# EAGLE schematic schützboard9 (EAGLE 4.16)
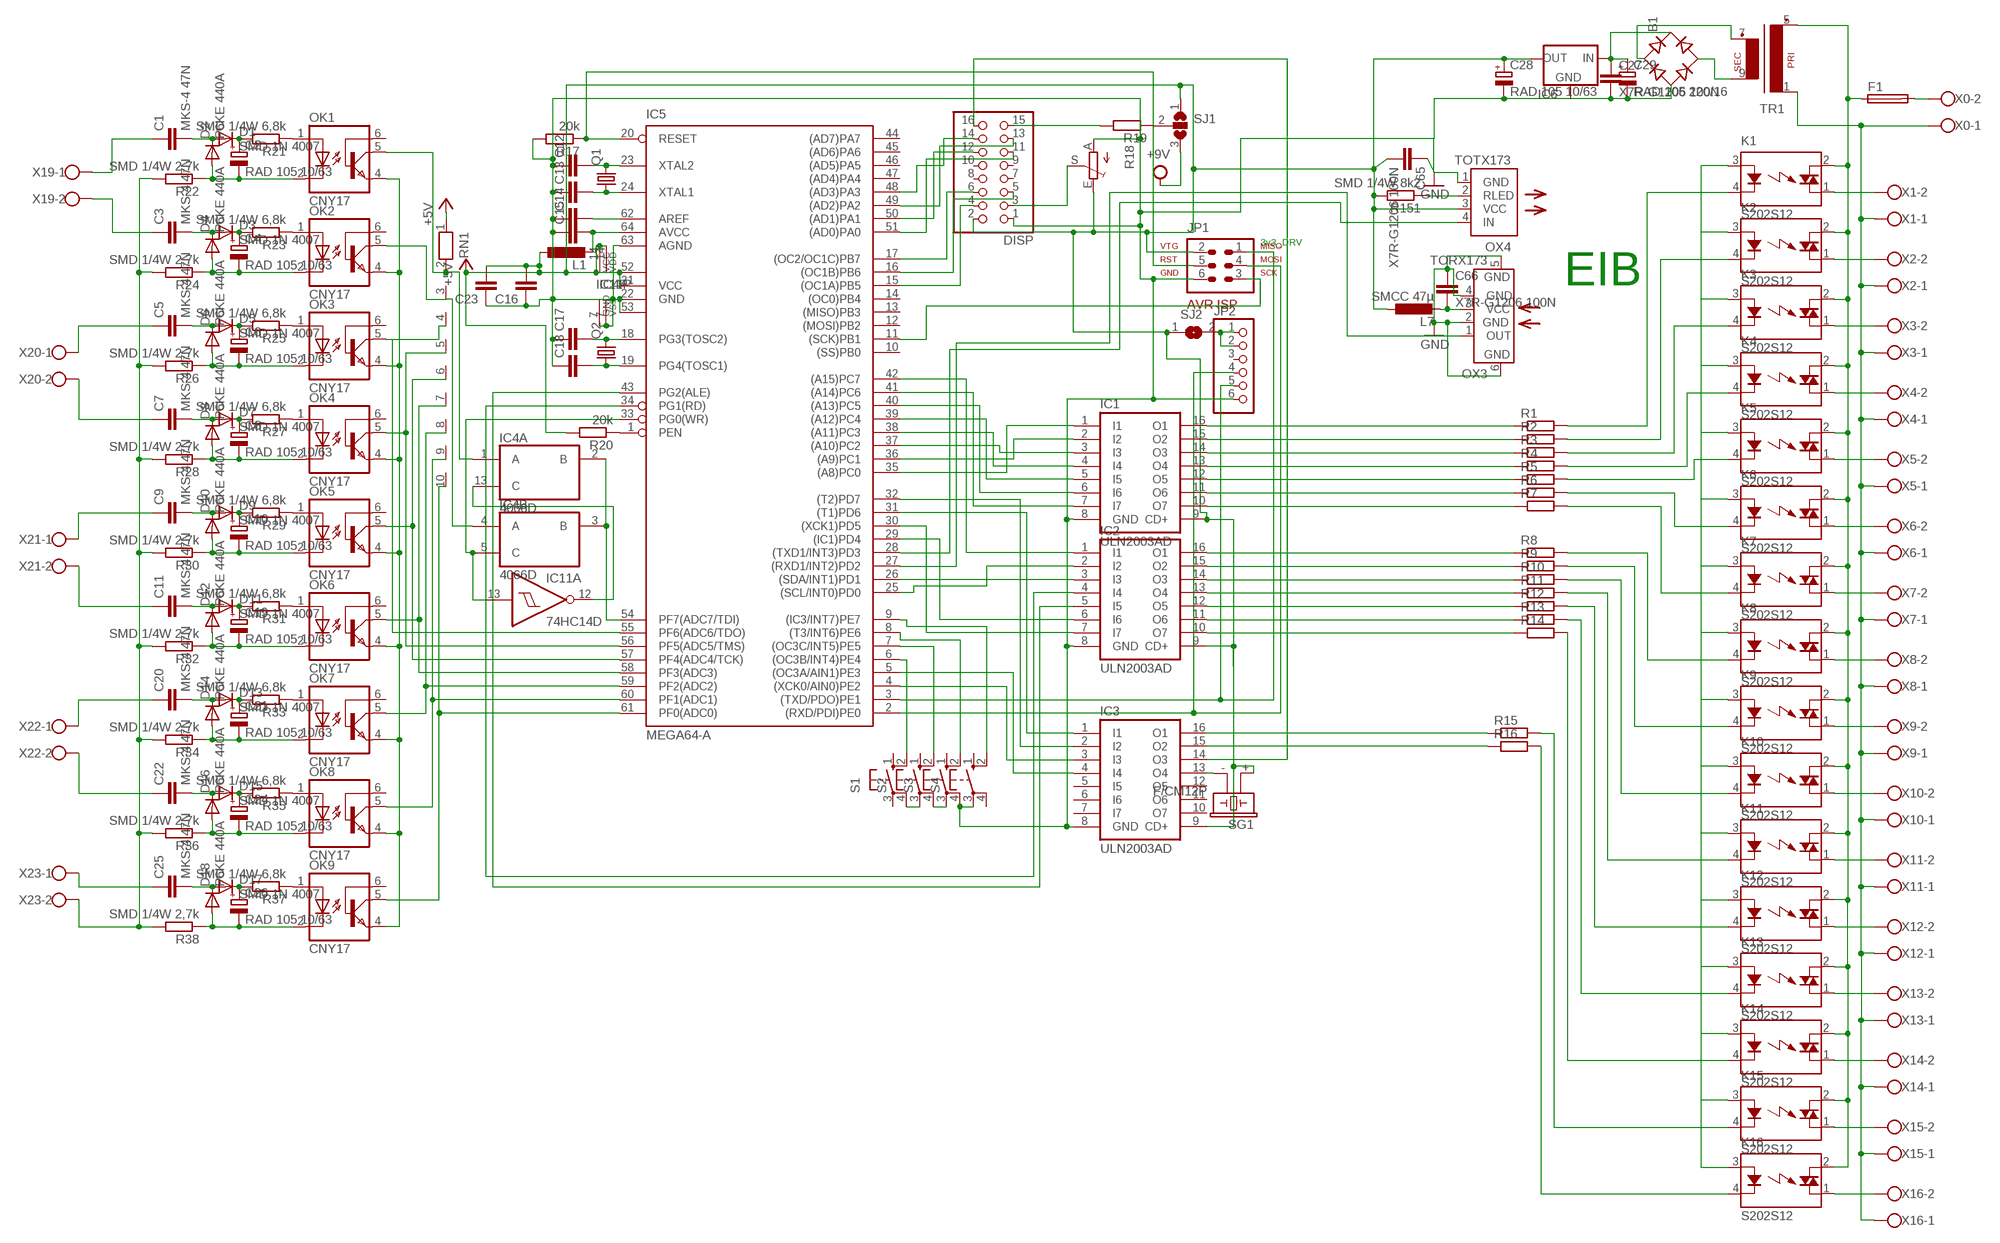
[diagram p0: schematic, sheet 1]

## Parts
B1  B-DIL  [B-DIL]
C1  MKS-4 47N  C-EU075-042X103  [C075-042X103]
C2  RAD 105 10/63  CPOL-EUE2.5-5  [E2,5-5]
C3  MKS-4 47N  C-EU075-042X103  [C075-042X103]
C4  RAD 105 10/63  CPOL-EUE2.5-5  [E2,5-5]
C5  MKS-4 47N  C-EU075-042X103  [C075-042X103]
C6  RAD 105 10/63  CPOL-EUE2.5-5  [E2,5-5]
C7  MKS-4 47N  C-EU075-042X103  [C075-042X103]
C8  RAD 105 10/63  CPOL-EUE2.5-5  [E2,5-5]
C9  MKS-4 47N  C-EU075-042X103  [C075-042X103]
C10  RAD 105 10/63  CPOL-EUE2.5-5  [E2,5-5]
C11  MKS-4 47N  C-EU075-042X103  [C075-042X103]
C12  C-EUC1206  [C1206]
C13  C-EUC1206  [C1206]
C14  C-EUC1206  [C1206]
C15  C-EUC1206  [C1206]
C16  C-EUC1206  [C1206]
C17  C-EUC1206  [C1206]
C18  C-EUC1206  [C1206]
C19  RAD 105 10/63  CPOL-EUE2.5-5  [E2,5-5]
C20  MKS-4 47N  C-EU075-042X103  [C075-042X103]
C21  RAD 105 10/63  CPOL-EUE2.5-5  [E2,5-5]
C22  MKS-4 47N  C-EU075-042X103  [C075-042X103]
C23  C-EUC1206  [C1206]
C24  RAD 105 10/63  CPOL-EUE2.5-5  [E2,5-5]
C25  MKS-4 47N  C-EU075-042X103  [C075-042X103]
C26  RAD 105 10/63  CPOL-EUE2.5-5  [E2,5-5]
C27  X7R-G1206 100N  C-EUC1206  [C1206]
C28  RAD 105 10/63  CPOL-EUE2.5-5  [E2,5-5]
C29  RAD 105 220/16  CPOL-EUE2.5-7  [E2,5-7]
C65  X7R-G1206 100N  C-EUC1206  [C1206]
C66  X7R-G1206 100N  C-EUC1206  [C1206]
D1  SMD 1N 4007  DIODE-MELF-MLL41  [MELF-MLL41]
D2  P6KE 440A  DIODE-DO41-10  [DO41-10]
D3  SMD 1N 4007  DIODE-MELF-MLL41  [MELF-MLL41]
D4  P6KE 440A  DIODE-DO41-10  [DO41-10]
D5  SMD 1N 4007  DIODE-MELF-MLL41  [MELF-MLL41]
D6  P6KE 440A  DIODE-DO41-10  [DO41-10]
D7  SMD 1N 4007  DIODE-MELF-MLL41  [MELF-MLL41]
D8  P6KE 440A  DIODE-DO41-10  [DO41-10]
D9  SMD 1N 4007  DIODE-MELF-MLL41  [MELF-MLL41]
D10  P6KE 440A  DIODE-DO41-10  [DO41-10]
D11  SMD 1N 4007  DIODE-MELF-MLL41  [MELF-MLL41]
D12  P6KE 440A  DIODE-DO41-10  [DO41-10]
D13  SMD 1N 4007  DIODE-MELF-MLL41  [MELF-MLL41]
D14  P6KE 440A  DIODE-DO41-10  [DO41-10]
D15  SMD 1N 4007  DIODE-MELF-MLL41  [MELF-MLL41]
D16  P6KE 440A  DIODE-DO41-10  [DO41-10]
D17  SMD 1N 4007  DIODE-MELF-MLL41  [MELF-MLL41]
D18  P6KE 440A  DIODE-DO41-10  [DO41-10]
DISP  PINHD-2X8  [2X08]
F1  19560  [19560]
IC1  ULN2003AD  [SO16]
IC2  ULN2003AD  [SO16]
IC3  ULN2003AD  [SO16]
IC4  4066D  [SO14]
IC5  MEGA64-A  [TQFP64]
IC6  78XXS  [78XXS]
IC11  74HC14D  [SO14]
JP1  AVR-ISP-6  [AVR-ISP-6]
JP2  PINHD-1X6  [1X06]
K1  S202S12  [S2XXEX]
K2  S202S12  [S2XXEX]
K3  S202S12  [S2XXEX]
K4  S202S12  [S2XXEX]
K5  S202S12  [S2XXEX]
K6  S202S12  [S2XXEX]
K7  S202S12  [S2XXEX]
K8  S202S12  [S2XXEX]
K9  S202S12  [S2XXEX]
K10  S202S12  [S2XXEX]
K11  S202S12  [S2XXEX]
K12  S202S12  [S2XXEX]
K13  S202S12  [S2XXEX]
K14  S202S12  [S2XXEX]
K15  S202S12  [S2XXEX]
K16  S202S12  [S2XXEX]
L1  L-EU0207/10  [0207/10]
L7  SMCC 47µ  L-EU0207/10  [0207/10]
OK1  CNY17  [DIL06]
OK2  CNY17  [DIL06]
OK3  CNY17  [DIL06]
OK4  CNY17  [DIL06]
OK5  CNY17  [DIL06]
OK6  CNY17  [DIL06]
OK7  CNY17  [DIL06]
OK8  CNY17  [DIL06]
OK9  CNY17  [DIL06]
OX3  TORX173  [TORX173]
OX4  TOTX173  [TOTX173]
Q1  CRYSTALHC49UP  [HC49UP]
Q2  CRYSTALTC38H  [TC38H]
R1  R-EU_M1206  [M1206]
R2  R-EU_M1206  [M1206]
R3  R-EU_M1206  [M1206]
R4  R-EU_M1206  [M1206]
R5  R-EU_M1206  [M1206]
R6  R-EU_M1206  [M1206]
R7  R-EU_M1206  [M1206]
R8  R-EU_M1206  [M1206]
R9  R-EU_M1206  [M1206]
R10  R-EU_M1206  [M1206]
R11  R-EU_M1206  [M1206]
R12  R-EU_M1206  [M1206]
R13  R-EU_M1206  [M1206]
R14  R-EU_M1206  [M1206]
R15  R-EU_M1206  [M1206]
R16  R-EU_M1206  [M1206]
R17  20k  R-EU_M1206  [M1206]
R18  TRIM_EU-ST10  [ST10]
R19  R-EU_0207/5V  [0207/5V]
R20  20k  R-EU_M1206  [M1206]
R21  SMD 1/4W 6,8k  R-EU_M1206  [M1206]
R22  SMD 1/4W 2,7k  R-EU_M1206  [M1206]
R23  SMD 1/4W 6,8k  R-EU_M1206  [M1206]
R24  SMD 1/4W 2,7k  R-EU_M1206  [M1206]
R25  SMD 1/4W 6,8k  R-EU_M1206  [M1206]
R26  SMD 1/4W 2,7k  R-EU_M1206  [M1206]
R27  SMD 1/4W 6,8k  R-EU_M1206  [M1206]
R28  SMD 1/4W 2,7k  R-EU_M1206  [M1206]
R29  SMD 1/4W 6,8k  R-EU_M1206  [M1206]
R30  SMD 1/4W 2,7k  R-EU_M1206  [M1206]
R31  SMD 1/4W 6,8k  R-EU_M1206  [M1206]
R32  SMD 1/4W 2,7k  R-EU_M1206  [M1206]
R33  SMD 1/4W 6,8k  R-EU_M1206  [M1206]
R34  SMD 1/4W 2,7k  R-EU_M1206  [M1206]
R35  SMD 1/4W 6,8k  R-EU_M1206  [M1206]
R36  SMD 1/4W 2,7k  R-EU_M1206  [M1206]
R37  SMD 1/4W 6,8k  R-EU_M1206  [M1206]
R38  SMD 1/4W 2,7k  R-EU_M1206  [M1206]
R151  SMD 1/4W 8k2  R-R1206  [R1206]
RN1  RN09  [RN-10]
S1  10-XX  [B3F-10XX]
S2  10-XX  [B3F-10XX]
S3  10-XX  [B3F-10XX]
S4  10-XX  [B3F-10XX]
SG1  F/CM12P  [F/CM12P]
SJ1  SJ2W  [SJ_2]
SJ2  SJ  [SJ]
TR1  EI30-1  [EI30-1]
X0  W237-02P  [W237-132]
X1  W237-02P  [W237-132]
X2  W237-02P  [W237-132]
X3  W237-02P  [W237-132]
X4  W237-02P  [W237-132]
X5  W237-02P  [W237-132]
X6  W237-02P  [W237-132]
X7  W237-02P  [W237-132]
X8  W237-02P  [W237-132]
X9  W237-02P  [W237-132]
X10  W237-02P  [W237-132]
X11  W237-02P  [W237-132]
X12  W237-02P  [W237-132]
X13  W237-02P  [W237-132]
X14  W237-02P  [W237-132]
X15  W237-02P  [W237-132]
X16  W237-02P  [W237-132]
X19  W237-02P  [W237-132]
X20  W237-02P  [W237-132]
X21  W237-02P  [W237-132]
X22  W237-02P  [W237-132]
X23  W237-02P  [W237-132]

## Nets
+5V: C16.2 C23.2 C28.+ C65.2 DISP.2 IC1.9(CD+) IC2.9(CD+) IC3.9(CD+) IC4.14(P:VDD) IC5.21(VCC) IC5.52(VCC1) IC6.OUT IC11.14(P:VCC) JP1.2 L1.1 L7.1 OX4.3(VCC) R18.E R20.2 R151.2 RN1.1 SG1.+ SJ1.1 SJ2.1
+9V: SJ1.3
GND: B1.- C12.1 C13.1 C14.1 C15.1 C16.1 C17.1 C18.1 C23.1 C27.2 C28.- C29.- C65.1 C66.1 DISP.1 IC1.8(GND) IC2.8(GND) IC3.8(GND) IC4.7(P:VSS) IC5.22(GND) IC5.53(GND1) IC5.63(AGND) IC6.GND IC11.7(P:GND) JP1.6 JP2.6 OX3.2(GND) OX3.4(GND) OX3.5(GND) OX3.6(GND) OX4.1(GND) R17.2 R18.A S3.4(P1) S4.3(P)
N$1: JP2.1 JP2.2 SJ2.2
N$2: IC1.1(I1) IC5.35((A8)PC0)
N$3: IC1.2(I2) IC5.36((A9)PC1)
N$4: IC1.3(I3) IC5.37((A10)PC2)
N$5: IC1.4(I4) IC5.38((A11)PC3)
N$6: IC1.16(O1) R1.1
N$7: IC1.15(O2) R2.1
N$8: IC1.14(O3) R3.1
N$9: IC1.13(O4) R4.1
N$10: IC1.12(O5) R5.1
N$11: IC1.11(O6) R6.1
N$12: IC1.10(O7) R7.1
N$13: IC2.16(O1) R8.1
N$14: IC2.15(O2) R9.1
N$15: IC2.14(O3) R10.1
N$16: IC2.13(O4) R11.1
N$17: K1.4(K) R1.2
N$18: K2.4(K) R2.2
N$19: K3.4(K) R3.2
N$20: K4.4(K) R4.2
N$21: K5.4(K) R5.2
N$22: K6.4(K) R6.2
N$23: K7.4(K) R7.2
N$24: K8.4(K) R8.2
N$25: K9.4(K) R9.2
N$26: K10.4(K) R10.2
N$27: K11.4(K) R11.2
N$28: IC2.12(O5) R12.1
N$29: K12.4(K) R12.2
N$30: IC3.13(O4) SG1.-
N$31: IC2.11(O6) R13.1
N$32 [230vpow]: F1.2 X0.2
N$33: IC2.10(O7) R14.1
N$34 [230vpow]: K1.1(DS2) X1.2
N$35 [230vpow]: K2.1(DS2) X2.2
N$36 [230vpow]: K3.1(DS2) X3.2
N$37 [230vpow]: K4.1(DS2) X4.2
N$38 [230vpow]: K5.1(DS2) X5.2
N$39 [230vpow]: K6.1(DS2) X6.2
N$40 [230vpow]: K7.1(DS2) X7.2
N$41 [230vpow]: K8.1(DS2) X8.2
N$42 [230vpow]: K11.1(DS2) X11.2
N$43 [230vpow]: K12.1(DS2) X12.2
N$44: IC3.16(O1) R15.1
N$45 [230vpow]: K10.1(DS2) X10.2
N$46 [230vpow]: K9.1(DS2) X9.2
N$47: IC3.15(O2) R16.1
N$48: IC5.11((SCK)PB1) JP1.3
N$49: IC1.5(I5) IC5.39((A12)PC4)
N$50: IC1.6(I6) IC5.40((A13)PC5)
N$51: IC1.7(I7) IC5.41((A14)PC6)
N$52: K13.4(K) R13.2
N$53: K14.4(K) R14.2
N$54: K15.4(K) R15.2
N$55: IC2.2(I2) IC5.25((SCL/INT0)PD0)
N$56: K16.4(K) R16.2
N$57: IC5.3((TXD/PDO)PE1) JP1.1 JP2.5
N$58: K1.3(A) K2.3(A) K3.3(A) K4.3(A) K5.3(A) K6.3(A) K7.3(A) K8.3(A) K9.3(A) K10.3(A) K11.3(A) K12.3(A) K13.3(A) K14.3(A) K15.3(A) K16.3(A)
N$59 [230vpow]: F1.1 K1.2(DS1) K2.2(DS1) K3.2(DS1) K4.2(DS1) K5.2(DS1) K6.2(DS1) K7.2(DS1) K8.2(DS1) K9.2(DS1) K10.2(DS1) K11.2(DS1) K12.2(DS1) K13.2(DS1) K14.2(DS1) K15.2(DS1) K16.2(DS1) TR1.5(P2)
N$60 [230vpow]: K15.1(DS2) X15.2
N$61 [230vpow]: K16.1(DS2) X16.2
N$62 [230vpow]: TR1.1 X0.1 X1.1 X2.1 X3.1 X4.1 X5.1 X6.1 X7.1 X8.1 X9.1 X10.1 X11.1 X12.1 X13.1 X14.1 X15.1 X16.1
N$63 [230vpow]: K14.1(DS2) X14.2
N$64 [230vpow]: K13.1(DS2) X13.2
N$65: IC2.3(I3) IC5.26((SDA/INT1)PD1)
N$66: IC5.28((TXD1/INT3)PD3) OX4.4(IN)
N$67: IC5.27((RXD1/INT2)PD2) OX3.1(OUT)
N$68: IC5.20(RESET) JP1.5 R17.1
N$69: IC2.6(I6) IC5.29((IC1)PD4)
N$70: IC2.7(I7) IC5.30((XCK1)PD5)
N$71: IC2.1(I1) IC5.42((A15)PC7)
N$72: IC3.1(I1) IC5.31((T1)PD6)
N$73: C18.2 IC5.19(PG4(TOSC1)) Q2.1
N$74: IC3.2(I2) IC5.32((T2)PD7)
N$75: IC3.4(I4) IC5.5((OC3A/AIN1)PE3)
N$76: IC3.3(I3) IC5.4((XCK0/AIN0)PE2)
N$77: OK1.4(EMI) OK2.4(EMI) OK3.4(EMI) OK4.4(EMI) OK5.4(EMI) OK6.4(EMI) OK7.4(EMI) OK8.4(EMI) OK9.4(EMI)
N$78: IC4.1(A:A) OK1.5(COL) RN1.2
N$79: IC4.4(B:A) OK2.5(COL) RN1.3
N$80: IC5.55(PF6(ADC6/TDO)) OK3.5(COL) RN1.4
N$81: IC5.56(PF5(ADC5/TMS)) OK4.5(COL) RN1.5
N$82: IC5.57(PF4(ADC4/TCK)) OK5.5(COL) RN1.6
N$83: IC5.58(PF3(ADC3)) OK6.5(COL) RN1.7
N$84: IC5.59(PF2(ADC2)) OK7.5(COL) RN1.8
N$85: IC5.60(PF1(ADC1)) OK8.5(COL) RN1.9
N$86: IC5.61(PF0(ADC0)) OK9.5(COL) RN1.10
N$87: IC4.2(A:B) IC4.3(B:B) IC5.54(PF7(ADC7/TDI))
N$88: IC4.5(B:C) IC5.33(PG0(WR)) IC11.13(A:I)
N$89: C13.2 IC5.24(XTAL1) Q1.1
N$90: C12.2 IC5.23(XTAL2) Q1.2
N$91: C14.2 IC5.62(AREF)
N$92: C15.2 IC5.64(AVCC) L1.2
N$93: C17.2 IC5.18(PG3(TOSC2)) Q2.2
N$94: IC4.13(A:C) IC11.12(A:O)
N$95 [230vsteuer]: OK1.1(A) R21.1
N$96 [230vsteuer]: C2.+ D1.C R21.2
N$97 [230vsteuer]: C1.2 D1.A D2.C
N$98 [230vsteuer]: C2.- D2.A OK1.2(C) R22.1
N$99 [230vsteuer]: C4.+ D3.C R23.2
N$100 [230vsteuer]: C3.2 D3.A D4.C
N$101 [230vsteuer]: C4.- D4.A OK2.2(C) R24.1
N$102 [230vsteuer]: C6.+ D5.C R25.2
N$103 [230vsteuer]: C5.2 D5.A D6.C
N$104 [230vsteuer]: C6.- D6.A OK3.2(C) R26.1
N$105 [230vsteuer]: C8.+ D7.C R27.2
N$106: DISP.3 R18.S
N$107 [230vsteuer]: C7.2 D7.A D8.C
N$108 [230vsteuer]: C8.- D8.A OK4.2(C) R28.1
N$109 [230vsteuer]: C10.+ D9.C R29.2
N$110 [230vsteuer]: C9.2 D9.A D10.C
N$111 [230vsteuer]: C10.- D10.A OK5.2(C) R30.1
N$112 [230vsteuer]: C19.+ D11.C R31.2
N$113 [230vsteuer]: C11.2 D11.A D12.C
N$114: DISP.15 R19.2
N$115: DISP.16 IC3.14(O3)
N$116 [230vsteuer]: C19.- D12.A OK6.2(C) R32.1
N$117 [230vsteuer]: C21.+ D13.C R33.2
N$118 [230vsteuer]: C20.2 D13.A D14.C
N$119 [230vsteuer]: C21.- D14.A OK7.2(C) R34.1
N$120 [230vsteuer]: C24.+ D15.C R35.2
N$121 [230vsteuer]: C22.2 D15.A D16.C
N$122 [230vsteuer]: C24.- D16.A OK8.2(C) R36.1
N$123 [230vsteuer]: C26.+ D17.C R37.2
N$124 [230vsteuer]: C25.2 D17.A D18.C
N$125 [230vsteuer]: C26.- D18.A OK9.2(C) R38.1
N$126 [230vsteuer]: R22.2 R24.2 R26.2 R28.2 R30.2 R32.2 R34.2 R36.2 R38.2 X23.2
N$127 [230vsteuer]: C1.1 X19.1
N$128: R19.1 SJ1.2
N$129 [230vsteuer]: C3.1 X19.2
N$130 [230vsteuer]: C5.1 X20.1
N$131 [230vsteuer]: C7.1 X20.2
N$132 [230vsteuer]: C9.1 X21.1
N$133 [230vsteuer]: C11.1 X21.2
N$134 [230vsteuer]: C20.1 X22.1
N$135 [230vsteuer]: C22.1 X22.2
N$136 [230vsteuer]: C25.1 X23.1
N$137: S1.4(P1) S2.3(P)
N$138: S2.4(P1) S3.3(P)
N$139: IC5.6((OC3B/INT4)PE4) S1.2(S1)
N$140: IC5.7((OC3C/INT5)PE5) S2.2(S1)
N$141: IC5.1(PEN) R20.1
N$142: IC5.8((T3/INT6)PE6) S3.2(S1)
N$143: IC5.9((IC3/INT7)PE7) S4.2(S1)
N$144: OK9.1(A) R37.1
N$145: OK8.1(A) R35.1
N$146: OK7.1(A) R33.1
N$147: OK6.1(A) R31.1
N$148: OK5.1(A) R29.1
N$149: OK4.1(A) R27.1
N$150: OK3.1(A) R25.1
N$151: OK2.1(A) R23.1
N$152: OX4.2(RLED) R151.1
N$153: IC2.4(I4) IC5.34(PG1(RD))
N$154: IC2.5(I5) IC5.43(PG2(ALE))
N$155: B1.AC2 TR1.9(S4)
N$156: B1.AC1 TR1.7(S3)
N$157: B1.+ C27.1 C29.+ IC6.IN
N$186: DISP.4 IC5.15((OC1A)PB5)
N$203: DISP.5 IC5.16((OC1B)PB6)
N$205: DISP.6 IC5.17((OC2/OC1C)PB7)
N$206: DISP.14 IC5.48((AD3)PA3)
N$207: DISP.13 IC5.49((AD2)PA2)
N$208: DISP.12 IC5.50((AD1)PA1)
N$209: DISP.11 IC5.51((AD0)PA0)
N$219: IC5.2((RXD/PDI)PE0) JP1.4 JP2.4
N$231: C66.2 L7.2 OX3.3(VCC)
Unconnected: DISP.7 DISP.8 DISP.9 DISP.10 IC3.5(I5) IC3.6(I6) IC3.7(I7) IC3.10(O7) IC3.11(O6) IC3.12(O5) IC4.6(C:C) IC4.8(C:A) IC4.9(C:B) IC4.10(D:B) IC4.11(D:A) IC4.12(D:C) IC5.10((SS)PB0) IC5.12((MOSI)PB2) IC5.13((MISO)PB3) IC5.14((OC0)PB4) IC5.44((AD7)PA7) IC5.45((AD6)PA6) IC5.46((AD5)PA5) IC5.47((AD4)PA4) IC11.1(D:I) IC11.2(D:O) IC11.3(E:I) IC11.4(E:O) IC11.5(F:I) IC11.6(F:O) IC11.8(C:O) IC11.9(C:I) IC11.10(B:O) IC11.11(B:I) JP2.3 OK1.6(BAS) OK2.6(BAS) OK3.6(BAS) OK4.6(BAS) OK5.6(BAS) OK6.6(BAS) OK7.6(BAS) OK8.6(BAS) OK9.6(BAS) S1.1(S) S1.3(P) S2.1(S) S3.1(S) S4.1(S) S4.4(P1)

## Notes on the sheet
- 3v3_DRV
- EIB

## Library data of the parts
B1 = rectifier:B-DIL: RECTIFIER
C1 C3 C5 C7 C9 C11-C18 C20 C22 C23 C25 C27 C65 C66 = rcl:C-EU: CAPACITOR, European symbol
C2 C4 C6 C8 C10 C19 C21 C24 C26 C28 C29 = rcl:CPOL-EU: POLARIZED CAPACITOR, European symbol
D1-D18 = diode:DIODE-: DIODE
DISP = pinhead:PINHD-2X8: PIN HEADER
F1 = fuse:19560: FUSE HOLDER TR5, Wickmann
IC1-IC3 = uln-udn:ULN2003A: DRIVER ARRAY
IC4 = 40xx:4066: Quad bilateral ANALOG SWITCH
IC5 = atmel:MEGA64: MICROCONTROLLER 64 Kbytes FLASH 4 Kbytes SRAM 2 Kbytes EEPROM DUAL USART 8-channel 10 bit ADC Source: avr.lbr
IC6 = v-reg:78XXS: VOLTAGE REGULATOR
IC11 = 74xx-eu:74*14: Hex schmitt trigger INVERTER
JP1 = atmel-1:AVR-ISP-6: AVR ISP-6 Serial Programming Header
JP2 = pinhead:PINHD-1X6: PIN HEADER
K1-K16 = relay:S?*: Low Height Type Solid State Relays SHARP Source: 162574-da-01-en-S202T02_Solid_State_Relais.pdf Source: http://sharp-world.com .. s102s11_e.pdf
L1 L7 = rcl:L-EU: INDUCTOR, European symbol
OK1-OK9 = optocoupler:CNY17: SIEMENS OPTO COUPLER
OX3 = toshiba:TORX173: FIBER OPTIC RECEIVING MODULE FOR DIGITAL AUDIO EQUIPMENT, TTL Interface TORX173.pdf
OX4 = toshiba:TOTX173: FIBER OPTIC TRANSMITTING MODULE FOR DIGITAL AUDIO EQUIPMENT; TTL Interface TOTX173.pdf
Q1 Q2 = crystal:CRYSTAL: CRYSTAL
R1-R17 R19-R38 = rcl:R-EU_: RESISTOR, European symbol
R18 = pot:TRIM_EU-: POTENTIOMETER
R151 = quantum-sensor:R: Resistor
RN1 = resistor-net:RN09: RESISTOR NETWORK
S1-S4 = switch-omron2:10-XX: OMRON SWITCH
SG1 = buzzer:F/CM12P: BUZZER Source: Buerklin
SJ1 = jumper:SJ2W: SMD solder JUMPER
SJ2 = jumper:SJ: SMD solder JUMPER
TR1 = trafo:EI30-1: TRANSFORMER 1 primary winding, 1 secondary winding ERA
X0 X1-X16 X19-X23 = con-wago-508:W237-02P: WAGO SREW CLAMP

## Net classes
1 supply: width 0.254 mm
2 eib: width 0.203 mm, drill 0.508 mm
3 230vpow: width 3.048 mm, drill 1.524 mm, clearance 1 mm
4 230vsteuer: width 0.381 mm, drill 1.524 mm
6 vdig: width 0.254 mm